# Vivado block design design_1, xczu28dr-ffvg1517-2-e, Vivado 2019.1
# (continued, part 3 of 6)
current_bd_instance /tx_datapath/dac_block0_tile1
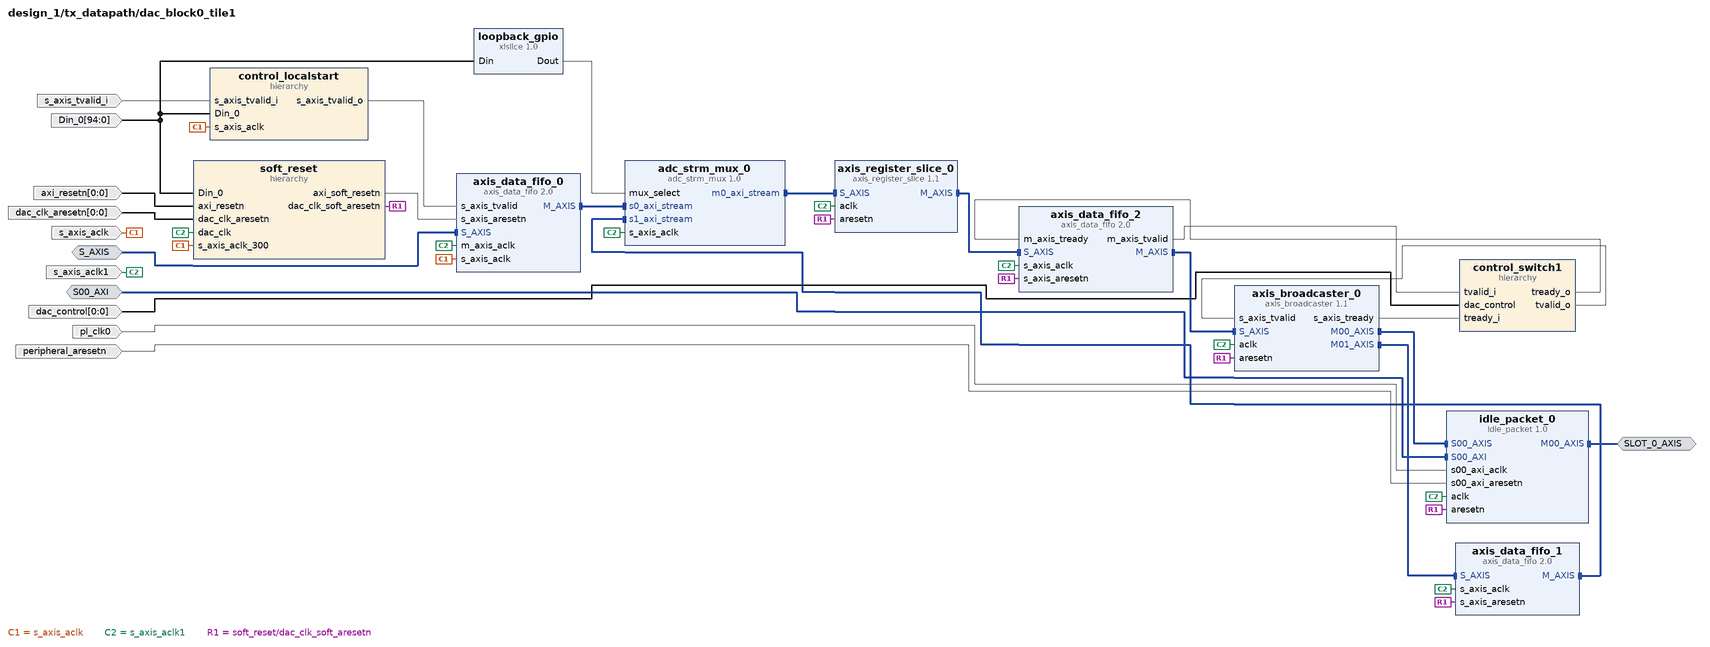
[diagram p42: block diagram inside /tx_datapath/dac_block0_tile1]
create_bd_intf_pin -mode Slave -vlnv xilinx.com:interface:axis_rtl:1.0 S_AXIS
create_bd_intf_pin -mode Master -vlnv xilinx.com:interface:axis_rtl:1.0 SLOT_0_AXIS
create_bd_intf_pin -mode Slave -vlnv xilinx.com:interface:aximm_rtl:1.0 S00_AXI
create_bd_pin -dir I -type clk s_axis_aclk
create_bd_pin -dir I -type clk s_axis_aclk1
create_bd_pin -dir I -from 0 -to 0 dac_control
create_bd_pin -dir I -from 94 -to 0 Din_0
create_bd_pin -dir I -from 0 -to 0 axi_resetn
create_bd_pin -dir I -from 0 -to 0 dac_clk_aresetn
create_bd_pin -dir I s_axis_tvalid_i
create_bd_pin -dir I -type clk pl_clk0
create_bd_pin -dir I -type rst peripheral_aresetn

create_bd_cell -type ip -vlnv xilinx.com:ip:axis_data_fifo:2.0 axis_data_fifo_0
set_property -dict [list \
  CONFIG.FIFO_DEPTH 16 \
  CONFIG.FIFO_MEMORY_TYPE block \
  CONFIG.HAS_RD_DATA_COUNT 1 \
  CONFIG.HAS_TKEEP 1 \
  CONFIG.HAS_TLAST 1 \
  CONFIG.HAS_WR_DATA_COUNT 1 \
  CONFIG.IS_ACLK_ASYNC 1 \
  CONFIG.SYNCHRONIZATION_STAGES 2 \
  CONFIG.TDATA_NUM_BYTES 32 \
] [get_bd_cells axis_data_fifo_0]
create_bd_cell -type ip -vlnv xilinx.com:ip:axis_data_fifo:2.0 axis_data_fifo_1
set_property -dict [list \
  CONFIG.FIFO_DEPTH 16 \
  CONFIG.FIFO_MEMORY_TYPE block \
  CONFIG.HAS_RD_DATA_COUNT 1 \
  CONFIG.HAS_TKEEP 1 \
  CONFIG.HAS_TLAST 1 \
  CONFIG.HAS_WR_DATA_COUNT 1 \
  CONFIG.TDATA_NUM_BYTES 32 \
] [get_bd_cells axis_data_fifo_1]
create_bd_cell -type ip -vlnv xilinx.com:ip:axis_data_fifo:2.0 axis_data_fifo_2
set_property -dict [list \
  CONFIG.FIFO_DEPTH 4096 \
  CONFIG.FIFO_MEMORY_TYPE block \
  CONFIG.HAS_RD_DATA_COUNT 1 \
  CONFIG.HAS_TKEEP 1 \
  CONFIG.HAS_TLAST 1 \
  CONFIG.HAS_WR_DATA_COUNT 1 \
  CONFIG.TDATA_NUM_BYTES 32 \
] [get_bd_cells axis_data_fifo_2]
create_bd_cell -type ip -vlnv user.org:user:adc_strm_mux:1.0 adc_strm_mux_0
create_bd_cell -type ip -vlnv xilinx.com:ip:axis_register_slice:1.1 axis_register_slice_0
set_property -dict {CONFIG.HAS_TKEEP 1 CONFIG.HAS_TLAST 1 CONFIG.TDATA_NUM_BYTES 32} [get_bd_cells axis_register_slice_0]
create_bd_cell -type hier soft_reset
create_bd_cell -type ip -vlnv xilinx.com:ip:axis_broadcaster:1.1 axis_broadcaster_0
set_property -dict [list \
  CONFIG.M00_TDATA_REMAP {tdata[255:0]} \
  CONFIG.M01_TDATA_REMAP {tdata[255:0]} \
  CONFIG.M_TDATA_NUM_BYTES 32 \
  CONFIG.S_TDATA_NUM_BYTES 32 \
] [get_bd_cells axis_broadcaster_0]
create_bd_cell -type ip -vlnv xilinx.com:ip:xlslice:1.0 loopback_gpio
set_property -dict {CONFIG.DIN_FROM 12 CONFIG.DIN_TO 12 CONFIG.DIN_WIDTH 95 CONFIG.DOUT_WIDTH 1} [get_bd_cells loopback_gpio]
create_bd_cell -type hier control_switch1
create_bd_cell -type hier control_localstart
create_bd_cell -type ip -vlnv user.org:user:idle_packet:1.0 idle_packet_0

# ---- hierarchy /tx_datapath/dac_block0_tile1/soft_reset ----
current_bd_instance /tx_datapath/dac_block0_tile1/soft_reset
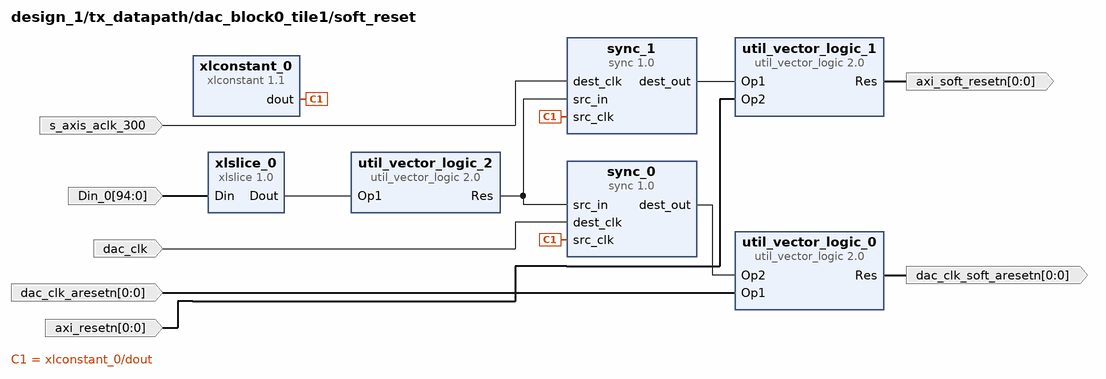
[diagram p43: block diagram inside /tx_datapath/dac_block0_tile1/soft_reset]
create_bd_pin -dir I -from 94 -to 0 Din_0
create_bd_pin -dir I -type clk dac_clk
create_bd_pin -dir I -type clk s_axis_aclk_300
create_bd_pin -dir O -from 0 -to 0 dac_clk_soft_aresetn
create_bd_pin -dir O -from 0 -to 0 axi_soft_resetn
create_bd_pin -dir I -from 0 -to 0 dac_clk_aresetn
create_bd_pin -dir I -from 0 -to 0 axi_resetn

create_bd_cell -type ip -vlnv xilinx.com:ip:xlslice:1.0 xlslice_0
set_property -dict {CONFIG.DIN_FROM 4 CONFIG.DIN_TO 4 CONFIG.DIN_WIDTH 95 CONFIG.DOUT_WIDTH 1} [get_bd_cells xlslice_0]
create_bd_cell -type ip -vlnv xilinx.com:user:sync:1.0 sync_0
set_property -dict {CONFIG.SRC_INPUT_REG 0} [get_bd_cells sync_0]
create_bd_cell -type ip -vlnv xilinx.com:user:sync:1.0 sync_1
set_property -dict {CONFIG.SRC_INPUT_REG 0} [get_bd_cells sync_1]
create_bd_cell -type ip -vlnv xilinx.com:ip:xlconstant:1.1 xlconstant_0
set_property -dict {CONFIG.CONST_VAL 0} [get_bd_cells xlconstant_0]
create_bd_cell -type ip -vlnv xilinx.com:ip:util_vector_logic:2.0 util_vector_logic_2
set_property -dict {CONFIG.C_OPERATION not CONFIG.C_SIZE 1} [get_bd_cells util_vector_logic_2]
create_bd_cell -type ip -vlnv xilinx.com:ip:util_vector_logic:2.0 util_vector_logic_0
set_property -dict {CONFIG.C_SIZE 1} [get_bd_cells util_vector_logic_0]
create_bd_cell -type ip -vlnv xilinx.com:ip:util_vector_logic:2.0 util_vector_logic_1
set_property -dict {CONFIG.C_SIZE 1} [get_bd_cells util_vector_logic_1]

# ---- hierarchy /tx_datapath/dac_block0_tile1/control_switch1 ----
current_bd_instance /tx_datapath/dac_block0_tile1/control_switch1
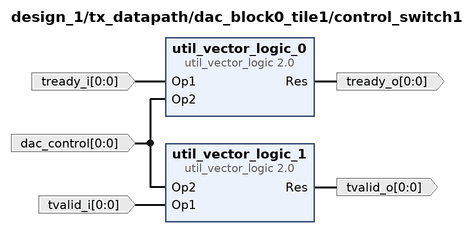
[diagram p44: block diagram inside /tx_datapath/dac_block0_tile1/control_switch1]
create_bd_pin -dir I -from 0 -to 0 tready_i
create_bd_pin -dir I -from 0 -to 0 tvalid_i
create_bd_pin -dir O -from 0 -to 0 tready_o
create_bd_pin -dir O -from 0 -to 0 tvalid_o
create_bd_pin -dir I -from 0 -to 0 dac_control

create_bd_cell -type ip -vlnv xilinx.com:ip:util_vector_logic:2.0 util_vector_logic_0
set_property -dict {CONFIG.C_SIZE 1} [get_bd_cells util_vector_logic_0]
create_bd_cell -type ip -vlnv xilinx.com:ip:util_vector_logic:2.0 util_vector_logic_1
set_property -dict {CONFIG.C_SIZE 1} [get_bd_cells util_vector_logic_1]

# ---- hierarchy /tx_datapath/dac_block0_tile1/control_localstart ----
current_bd_instance /tx_datapath/dac_block0_tile1/control_localstart
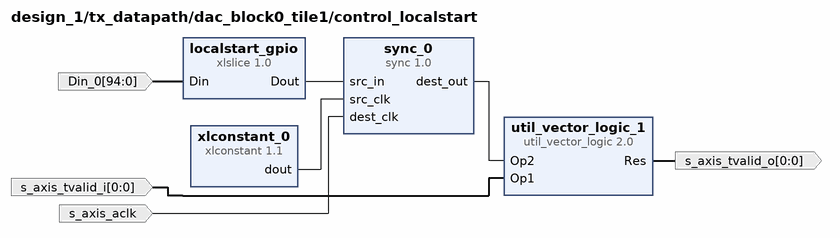
[diagram p45: block diagram inside /tx_datapath/dac_block0_tile1/control_localstart]
create_bd_pin -dir I -from 0 -to 0 s_axis_tvalid_i
create_bd_pin -dir O -from 0 -to 0 s_axis_tvalid_o
create_bd_pin -dir I -from 94 -to 0 Din_0
create_bd_pin -dir I -type clk s_axis_aclk

create_bd_cell -type ip -vlnv xilinx.com:ip:util_vector_logic:2.0 util_vector_logic_1
set_property -dict {CONFIG.C_SIZE 1} [get_bd_cells util_vector_logic_1]
create_bd_cell -type ip -vlnv xilinx.com:ip:xlslice:1.0 localstart_gpio
set_property -dict {CONFIG.DIN_FROM 20 CONFIG.DIN_TO 20 CONFIG.DIN_WIDTH 95 CONFIG.DOUT_WIDTH 1} [get_bd_cells localstart_gpio]
create_bd_cell -type ip -vlnv xilinx.com:user:sync:1.0 sync_0
set_property -dict {CONFIG.DEST_SYNC_FF 2 CONFIG.SRC_INPUT_REG 0} [get_bd_cells sync_0]
create_bd_cell -type ip -vlnv xilinx.com:ip:xlconstant:1.1 xlconstant_0
set_property -dict {CONFIG.CONST_VAL 0} [get_bd_cells xlconstant_0]

# ---- hierarchy /tx_datapath/dac_block1_tile1 ----
current_bd_instance /tx_datapath/dac_block1_tile1
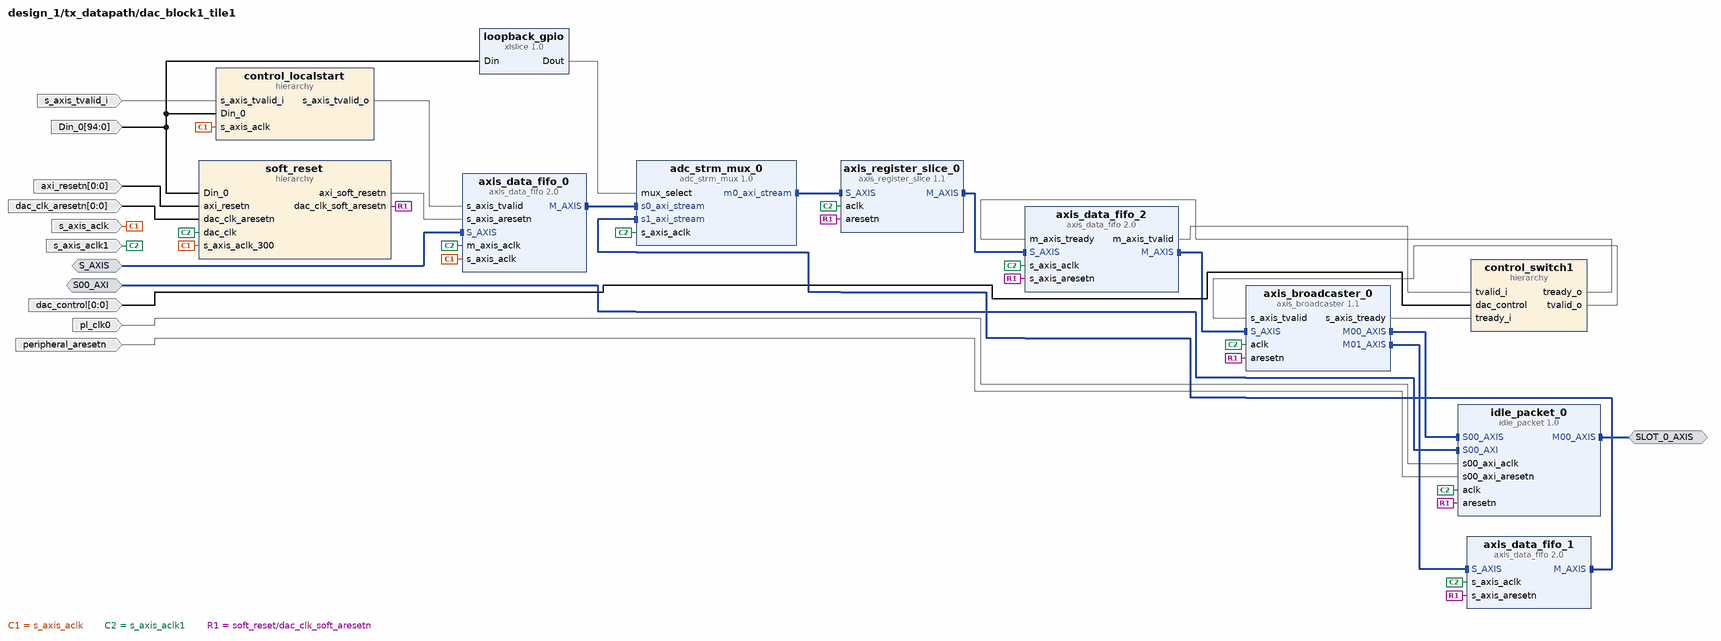
[diagram p46: block diagram inside /tx_datapath/dac_block1_tile1]
create_bd_intf_pin -mode Slave -vlnv xilinx.com:interface:axis_rtl:1.0 S_AXIS
create_bd_intf_pin -mode Master -vlnv xilinx.com:interface:axis_rtl:1.0 SLOT_0_AXIS
create_bd_intf_pin -mode Slave -vlnv xilinx.com:interface:aximm_rtl:1.0 S00_AXI
create_bd_pin -dir I -type clk s_axis_aclk
create_bd_pin -dir I -type clk s_axis_aclk1
create_bd_pin -dir I -from 0 -to 0 dac_control
create_bd_pin -dir I -from 94 -to 0 Din_0
create_bd_pin -dir I -from 0 -to 0 axi_resetn
create_bd_pin -dir I -from 0 -to 0 dac_clk_aresetn
create_bd_pin -dir I s_axis_tvalid_i
create_bd_pin -dir I -type clk pl_clk0
create_bd_pin -dir I -type rst peripheral_aresetn

create_bd_cell -type ip -vlnv xilinx.com:ip:axis_data_fifo:2.0 axis_data_fifo_0
set_property -dict [list \
  CONFIG.FIFO_DEPTH 16 \
  CONFIG.FIFO_MEMORY_TYPE block \
  CONFIG.HAS_RD_DATA_COUNT 1 \
  CONFIG.HAS_TKEEP 1 \
  CONFIG.HAS_TLAST 1 \
  CONFIG.HAS_WR_DATA_COUNT 1 \
  CONFIG.IS_ACLK_ASYNC 1 \
  CONFIG.SYNCHRONIZATION_STAGES 2 \
  CONFIG.TDATA_NUM_BYTES 32 \
] [get_bd_cells axis_data_fifo_0]
create_bd_cell -type ip -vlnv xilinx.com:ip:axis_data_fifo:2.0 axis_data_fifo_1
set_property -dict [list \
  CONFIG.FIFO_DEPTH 16 \
  CONFIG.FIFO_MEMORY_TYPE block \
  CONFIG.HAS_RD_DATA_COUNT 1 \
  CONFIG.HAS_TKEEP 1 \
  CONFIG.HAS_TLAST 1 \
  CONFIG.HAS_WR_DATA_COUNT 1 \
  CONFIG.TDATA_NUM_BYTES 32 \
] [get_bd_cells axis_data_fifo_1]
create_bd_cell -type ip -vlnv xilinx.com:ip:axis_data_fifo:2.0 axis_data_fifo_2
set_property -dict [list \
  CONFIG.FIFO_DEPTH 4096 \
  CONFIG.FIFO_MEMORY_TYPE block \
  CONFIG.HAS_RD_DATA_COUNT 1 \
  CONFIG.HAS_TKEEP 1 \
  CONFIG.HAS_TLAST 1 \
  CONFIG.HAS_WR_DATA_COUNT 1 \
  CONFIG.TDATA_NUM_BYTES 32 \
] [get_bd_cells axis_data_fifo_2]
create_bd_cell -type ip -vlnv user.org:user:adc_strm_mux:1.0 adc_strm_mux_0
create_bd_cell -type ip -vlnv xilinx.com:ip:axis_register_slice:1.1 axis_register_slice_0
set_property -dict {CONFIG.HAS_TKEEP 1 CONFIG.HAS_TLAST 1 CONFIG.TDATA_NUM_BYTES 32} [get_bd_cells axis_register_slice_0]
create_bd_cell -type hier soft_reset
create_bd_cell -type ip -vlnv xilinx.com:ip:axis_broadcaster:1.1 axis_broadcaster_0
set_property -dict [list \
  CONFIG.M00_TDATA_REMAP {tdata[255:0]} \
  CONFIG.M01_TDATA_REMAP {tdata[255:0]} \
  CONFIG.M_TDATA_NUM_BYTES 32 \
  CONFIG.S_TDATA_NUM_BYTES 32 \
] [get_bd_cells axis_broadcaster_0]
create_bd_cell -type ip -vlnv xilinx.com:ip:xlslice:1.0 loopback_gpio
set_property -dict {CONFIG.DIN_FROM 13 CONFIG.DIN_TO 13 CONFIG.DIN_WIDTH 95 CONFIG.DOUT_WIDTH 1} [get_bd_cells loopback_gpio]
create_bd_cell -type hier control_switch1
create_bd_cell -type hier control_localstart
create_bd_cell -type ip -vlnv user.org:user:idle_packet:1.0 idle_packet_0

# ---- hierarchy /tx_datapath/dac_block1_tile1/soft_reset ----
current_bd_instance /tx_datapath/dac_block1_tile1/soft_reset
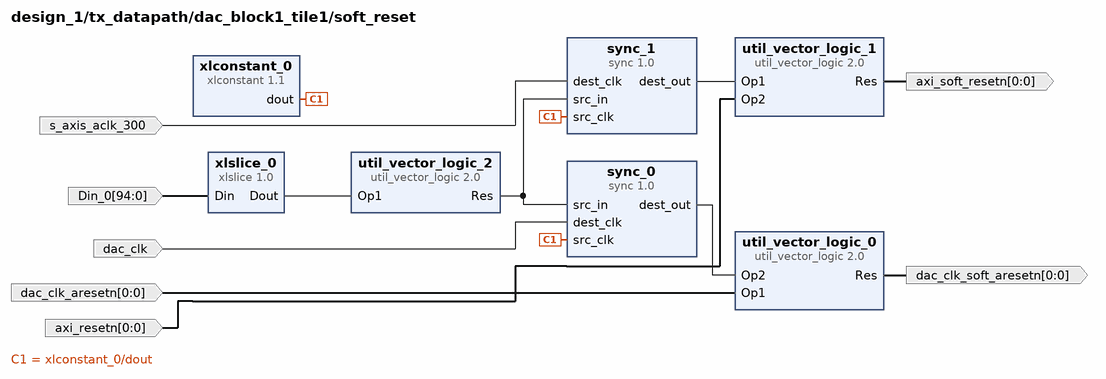
[diagram p47: block diagram inside /tx_datapath/dac_block1_tile1/soft_reset]
create_bd_pin -dir I -from 94 -to 0 Din_0
create_bd_pin -dir I -type clk dac_clk
create_bd_pin -dir I -type clk s_axis_aclk_300
create_bd_pin -dir O -from 0 -to 0 dac_clk_soft_aresetn
create_bd_pin -dir O -from 0 -to 0 axi_soft_resetn
create_bd_pin -dir I -from 0 -to 0 dac_clk_aresetn
create_bd_pin -dir I -from 0 -to 0 axi_resetn

create_bd_cell -type ip -vlnv xilinx.com:ip:xlslice:1.0 xlslice_0
set_property -dict {CONFIG.DIN_FROM 5 CONFIG.DIN_TO 5 CONFIG.DIN_WIDTH 95 CONFIG.DOUT_WIDTH 1} [get_bd_cells xlslice_0]
create_bd_cell -type ip -vlnv xilinx.com:user:sync:1.0 sync_0
set_property -dict {CONFIG.SRC_INPUT_REG 0} [get_bd_cells sync_0]
create_bd_cell -type ip -vlnv xilinx.com:user:sync:1.0 sync_1
set_property -dict {CONFIG.SRC_INPUT_REG 0} [get_bd_cells sync_1]
create_bd_cell -type ip -vlnv xilinx.com:ip:xlconstant:1.1 xlconstant_0
set_property -dict {CONFIG.CONST_VAL 0} [get_bd_cells xlconstant_0]
create_bd_cell -type ip -vlnv xilinx.com:ip:util_vector_logic:2.0 util_vector_logic_2
set_property -dict {CONFIG.C_OPERATION not CONFIG.C_SIZE 1} [get_bd_cells util_vector_logic_2]
create_bd_cell -type ip -vlnv xilinx.com:ip:util_vector_logic:2.0 util_vector_logic_0
set_property -dict {CONFIG.C_SIZE 1} [get_bd_cells util_vector_logic_0]
create_bd_cell -type ip -vlnv xilinx.com:ip:util_vector_logic:2.0 util_vector_logic_1
set_property -dict {CONFIG.C_SIZE 1} [get_bd_cells util_vector_logic_1]

# ---- hierarchy /tx_datapath/dac_block1_tile1/control_switch1 ----
current_bd_instance /tx_datapath/dac_block1_tile1/control_switch1
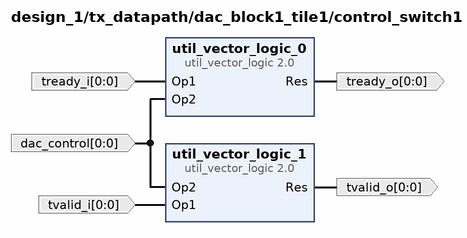
[diagram p48: block diagram inside /tx_datapath/dac_block1_tile1/control_switch1]
create_bd_pin -dir I -from 0 -to 0 tready_i
create_bd_pin -dir I -from 0 -to 0 tvalid_i
create_bd_pin -dir O -from 0 -to 0 tready_o
create_bd_pin -dir O -from 0 -to 0 tvalid_o
create_bd_pin -dir I -from 0 -to 0 dac_control

create_bd_cell -type ip -vlnv xilinx.com:ip:util_vector_logic:2.0 util_vector_logic_0
set_property -dict {CONFIG.C_SIZE 1} [get_bd_cells util_vector_logic_0]
create_bd_cell -type ip -vlnv xilinx.com:ip:util_vector_logic:2.0 util_vector_logic_1
set_property -dict {CONFIG.C_SIZE 1} [get_bd_cells util_vector_logic_1]

# ---- hierarchy /tx_datapath/dac_block1_tile1/control_localstart ----
current_bd_instance /tx_datapath/dac_block1_tile1/control_localstart
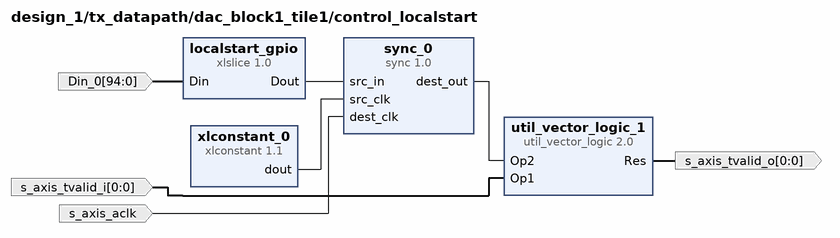
[diagram p49: block diagram inside /tx_datapath/dac_block1_tile1/control_localstart]
create_bd_pin -dir I -from 0 -to 0 s_axis_tvalid_i
create_bd_pin -dir O -from 0 -to 0 s_axis_tvalid_o
create_bd_pin -dir I -from 94 -to 0 Din_0
create_bd_pin -dir I -type clk s_axis_aclk

create_bd_cell -type ip -vlnv xilinx.com:ip:util_vector_logic:2.0 util_vector_logic_1
set_property -dict {CONFIG.C_SIZE 1} [get_bd_cells util_vector_logic_1]
create_bd_cell -type ip -vlnv xilinx.com:ip:xlslice:1.0 localstart_gpio
set_property -dict {CONFIG.DIN_FROM 21 CONFIG.DIN_TO 21 CONFIG.DIN_WIDTH 95 CONFIG.DOUT_WIDTH 1} [get_bd_cells localstart_gpio]
create_bd_cell -type ip -vlnv xilinx.com:user:sync:1.0 sync_0
set_property -dict {CONFIG.DEST_SYNC_FF 2 CONFIG.SRC_INPUT_REG 0} [get_bd_cells sync_0]
create_bd_cell -type ip -vlnv xilinx.com:ip:xlconstant:1.1 xlconstant_0
set_property -dict {CONFIG.CONST_VAL 0} [get_bd_cells xlconstant_0]

# ---- hierarchy /tx_datapath/dac_block3_tile1 ----
current_bd_instance /tx_datapath/dac_block3_tile1
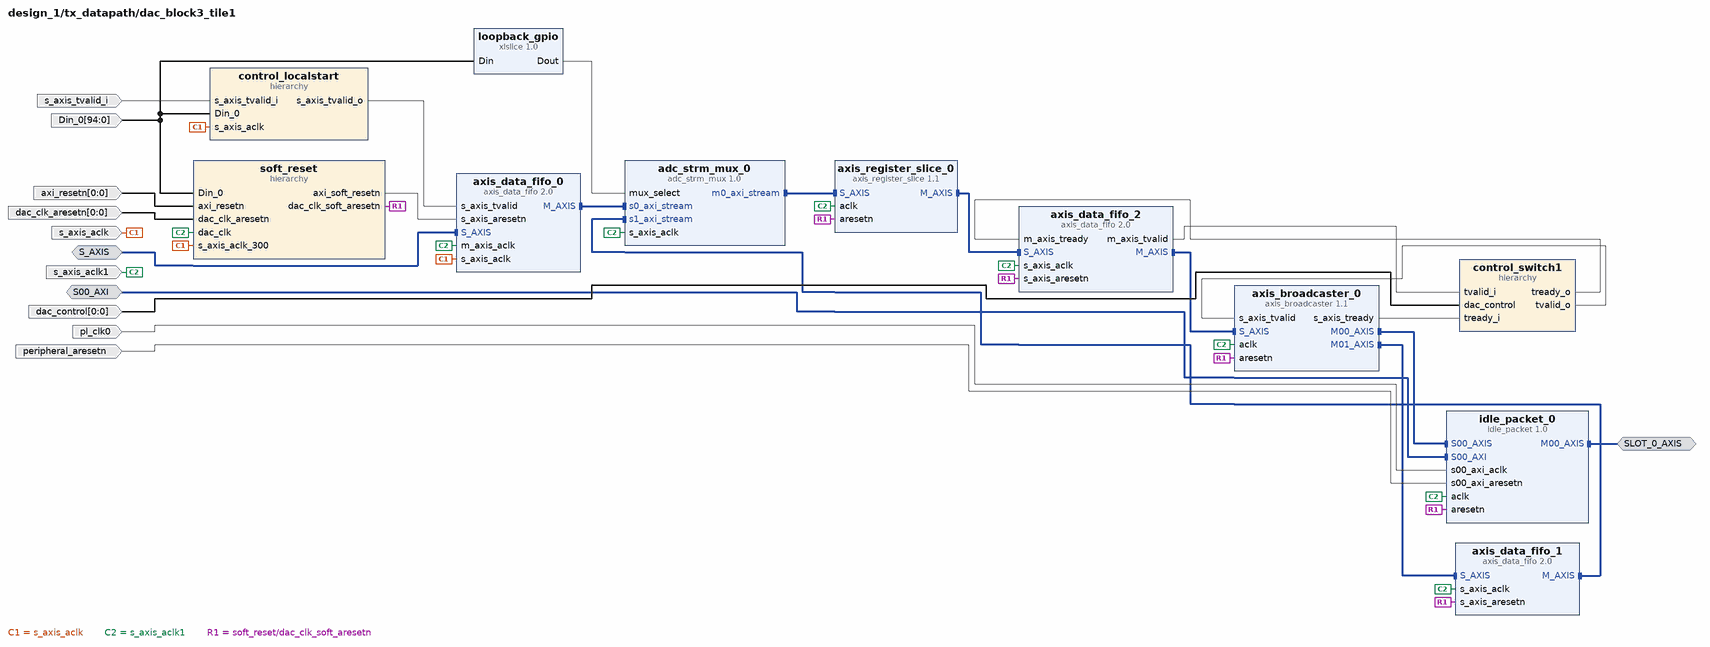
[diagram p50: block diagram inside /tx_datapath/dac_block3_tile1]
create_bd_intf_pin -mode Slave -vlnv xilinx.com:interface:axis_rtl:1.0 S_AXIS
create_bd_intf_pin -mode Master -vlnv xilinx.com:interface:axis_rtl:1.0 SLOT_0_AXIS
create_bd_intf_pin -mode Slave -vlnv xilinx.com:interface:aximm_rtl:1.0 S00_AXI
create_bd_pin -dir I -type clk s_axis_aclk
create_bd_pin -dir I -type clk s_axis_aclk1
create_bd_pin -dir I -from 0 -to 0 dac_control
create_bd_pin -dir I -from 94 -to 0 Din_0
create_bd_pin -dir I -from 0 -to 0 axi_resetn
create_bd_pin -dir I -from 0 -to 0 dac_clk_aresetn
create_bd_pin -dir I s_axis_tvalid_i
create_bd_pin -dir I -type clk pl_clk0
create_bd_pin -dir I -type rst peripheral_aresetn

create_bd_cell -type ip -vlnv xilinx.com:ip:axis_data_fifo:2.0 axis_data_fifo_0
set_property -dict [list \
  CONFIG.FIFO_DEPTH 16 \
  CONFIG.FIFO_MEMORY_TYPE block \
  CONFIG.HAS_RD_DATA_COUNT 1 \
  CONFIG.HAS_TKEEP 1 \
  CONFIG.HAS_TLAST 1 \
  CONFIG.HAS_WR_DATA_COUNT 1 \
  CONFIG.IS_ACLK_ASYNC 1 \
  CONFIG.SYNCHRONIZATION_STAGES 2 \
  CONFIG.TDATA_NUM_BYTES 32 \
] [get_bd_cells axis_data_fifo_0]
create_bd_cell -type ip -vlnv xilinx.com:ip:axis_data_fifo:2.0 axis_data_fifo_1
set_property -dict [list \
  CONFIG.FIFO_DEPTH 16 \
  CONFIG.FIFO_MEMORY_TYPE block \
  CONFIG.HAS_RD_DATA_COUNT 1 \
  CONFIG.HAS_TKEEP 1 \
  CONFIG.HAS_TLAST 1 \
  CONFIG.HAS_WR_DATA_COUNT 1 \
  CONFIG.TDATA_NUM_BYTES 32 \
] [get_bd_cells axis_data_fifo_1]
create_bd_cell -type ip -vlnv xilinx.com:ip:axis_data_fifo:2.0 axis_data_fifo_2
set_property -dict [list \
  CONFIG.FIFO_DEPTH 4096 \
  CONFIG.FIFO_MEMORY_TYPE block \
  CONFIG.HAS_RD_DATA_COUNT 1 \
  CONFIG.HAS_TKEEP 1 \
  CONFIG.HAS_TLAST 1 \
  CONFIG.HAS_WR_DATA_COUNT 1 \
  CONFIG.TDATA_NUM_BYTES 32 \
] [get_bd_cells axis_data_fifo_2]
create_bd_cell -type ip -vlnv user.org:user:adc_strm_mux:1.0 adc_strm_mux_0
create_bd_cell -type ip -vlnv xilinx.com:ip:axis_register_slice:1.1 axis_register_slice_0
set_property -dict {CONFIG.HAS_TKEEP 1 CONFIG.HAS_TLAST 1 CONFIG.TDATA_NUM_BYTES 32} [get_bd_cells axis_register_slice_0]
create_bd_cell -type hier soft_reset
create_bd_cell -type ip -vlnv xilinx.com:ip:axis_broadcaster:1.1 axis_broadcaster_0
set_property -dict [list \
  CONFIG.M00_TDATA_REMAP {tdata[255:0]} \
  CONFIG.M01_TDATA_REMAP {tdata[255:0]} \
  CONFIG.M_TDATA_NUM_BYTES 32 \
  CONFIG.S_TDATA_NUM_BYTES 32 \
] [get_bd_cells axis_broadcaster_0]
create_bd_cell -type ip -vlnv xilinx.com:ip:xlslice:1.0 loopback_gpio
set_property -dict {CONFIG.DIN_FROM 15 CONFIG.DIN_TO 15 CONFIG.DIN_WIDTH 95 CONFIG.DOUT_WIDTH 1} [get_bd_cells loopback_gpio]
create_bd_cell -type hier control_switch1
create_bd_cell -type hier control_localstart
create_bd_cell -type ip -vlnv user.org:user:idle_packet:1.0 idle_packet_0

# ---- hierarchy /tx_datapath/dac_block3_tile1/soft_reset ----
current_bd_instance /tx_datapath/dac_block3_tile1/soft_reset
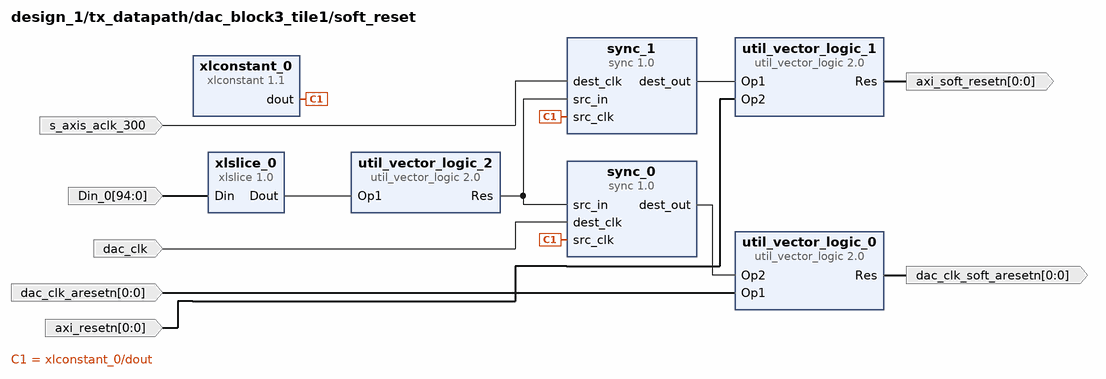
[diagram p51: block diagram inside /tx_datapath/dac_block3_tile1/soft_reset]
create_bd_pin -dir I -from 94 -to 0 Din_0
create_bd_pin -dir I -type clk dac_clk
create_bd_pin -dir I -type clk s_axis_aclk_300
create_bd_pin -dir O -from 0 -to 0 dac_clk_soft_aresetn
create_bd_pin -dir O -from 0 -to 0 axi_soft_resetn
create_bd_pin -dir I -from 0 -to 0 dac_clk_aresetn
create_bd_pin -dir I -from 0 -to 0 axi_resetn

create_bd_cell -type ip -vlnv xilinx.com:ip:xlslice:1.0 xlslice_0
set_property -dict {CONFIG.DIN_FROM 7 CONFIG.DIN_TO 7 CONFIG.DIN_WIDTH 95 CONFIG.DOUT_WIDTH 1} [get_bd_cells xlslice_0]
create_bd_cell -type ip -vlnv xilinx.com:user:sync:1.0 sync_0
set_property -dict {CONFIG.SRC_INPUT_REG 0} [get_bd_cells sync_0]
create_bd_cell -type ip -vlnv xilinx.com:user:sync:1.0 sync_1
set_property -dict {CONFIG.SRC_INPUT_REG 0} [get_bd_cells sync_1]
create_bd_cell -type ip -vlnv xilinx.com:ip:xlconstant:1.1 xlconstant_0
set_property -dict {CONFIG.CONST_VAL 0} [get_bd_cells xlconstant_0]
create_bd_cell -type ip -vlnv xilinx.com:ip:util_vector_logic:2.0 util_vector_logic_2
set_property -dict {CONFIG.C_OPERATION not CONFIG.C_SIZE 1} [get_bd_cells util_vector_logic_2]
create_bd_cell -type ip -vlnv xilinx.com:ip:util_vector_logic:2.0 util_vector_logic_0
set_property -dict {CONFIG.C_SIZE 1} [get_bd_cells util_vector_logic_0]
create_bd_cell -type ip -vlnv xilinx.com:ip:util_vector_logic:2.0 util_vector_logic_1
set_property -dict {CONFIG.C_SIZE 1} [get_bd_cells util_vector_logic_1]

# ---- hierarchy /tx_datapath/dac_block3_tile1/control_switch1 ----
current_bd_instance /tx_datapath/dac_block3_tile1/control_switch1
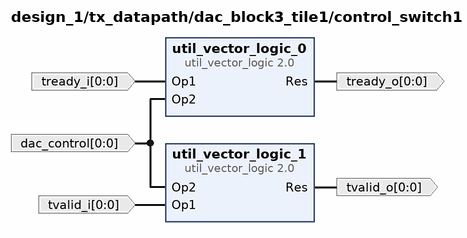
[diagram p52: block diagram inside /tx_datapath/dac_block3_tile1/control_switch1]
create_bd_pin -dir I -from 0 -to 0 tready_i
create_bd_pin -dir I -from 0 -to 0 tvalid_i
create_bd_pin -dir O -from 0 -to 0 tready_o
create_bd_pin -dir O -from 0 -to 0 tvalid_o
create_bd_pin -dir I -from 0 -to 0 dac_control

create_bd_cell -type ip -vlnv xilinx.com:ip:util_vector_logic:2.0 util_vector_logic_0
set_property -dict {CONFIG.C_SIZE 1} [get_bd_cells util_vector_logic_0]
create_bd_cell -type ip -vlnv xilinx.com:ip:util_vector_logic:2.0 util_vector_logic_1
set_property -dict {CONFIG.C_SIZE 1} [get_bd_cells util_vector_logic_1]

# ---- hierarchy /tx_datapath/dac_block3_tile1/control_localstart ----
current_bd_instance /tx_datapath/dac_block3_tile1/control_localstart
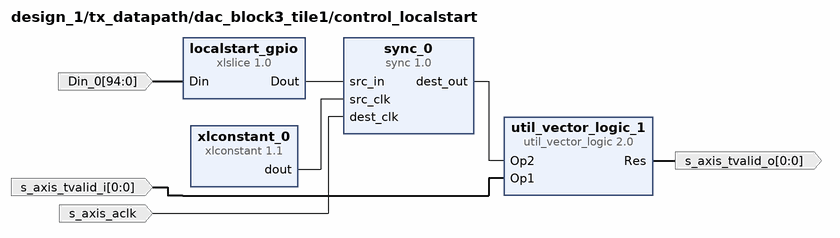
[diagram p53: block diagram inside /tx_datapath/dac_block3_tile1/control_localstart]
create_bd_pin -dir I -from 0 -to 0 s_axis_tvalid_i
create_bd_pin -dir O -from 0 -to 0 s_axis_tvalid_o
create_bd_pin -dir I -from 94 -to 0 Din_0
create_bd_pin -dir I -type clk s_axis_aclk

create_bd_cell -type ip -vlnv xilinx.com:ip:util_vector_logic:2.0 util_vector_logic_1
set_property -dict {CONFIG.C_SIZE 1} [get_bd_cells util_vector_logic_1]
create_bd_cell -type ip -vlnv xilinx.com:ip:xlslice:1.0 localstart_gpio
set_property -dict {CONFIG.DIN_FROM 23 CONFIG.DIN_TO 23 CONFIG.DIN_WIDTH 95 CONFIG.DOUT_WIDTH 1} [get_bd_cells localstart_gpio]
create_bd_cell -type ip -vlnv xilinx.com:user:sync:1.0 sync_0
set_property -dict {CONFIG.DEST_SYNC_FF 2 CONFIG.SRC_INPUT_REG 0} [get_bd_cells sync_0]
create_bd_cell -type ip -vlnv xilinx.com:ip:xlconstant:1.1 xlconstant_0
set_property -dict {CONFIG.CONST_VAL 0} [get_bd_cells xlconstant_0]

# ---- hierarchy /tx_datapath/tx_channelizer ----
current_bd_instance /tx_datapath/tx_channelizer
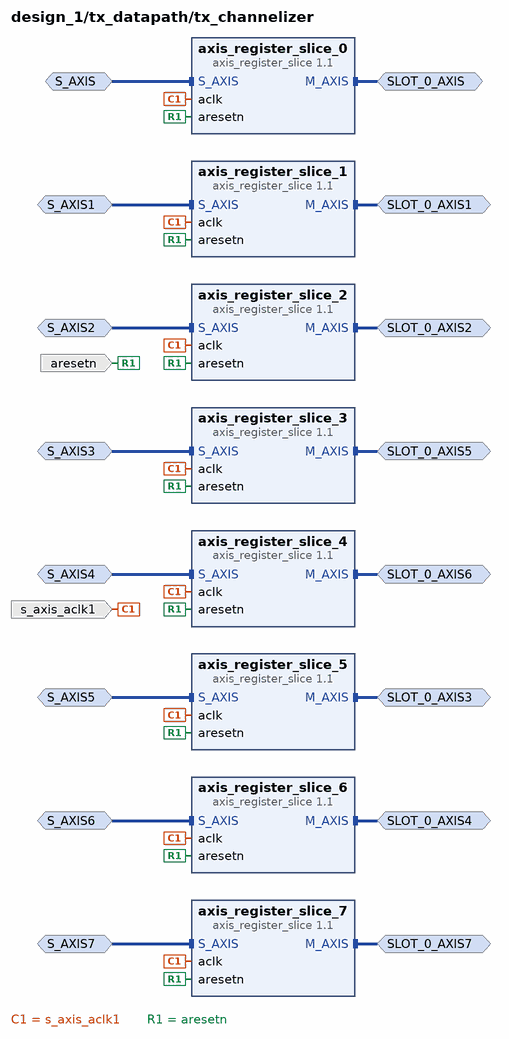
[diagram p54: block diagram inside /tx_datapath/tx_channelizer]
create_bd_intf_pin -mode Slave -vlnv xilinx.com:interface:axis_rtl:1.0 S_AXIS
create_bd_intf_pin -mode Master -vlnv xilinx.com:interface:axis_rtl:1.0 SLOT_0_AXIS
create_bd_intf_pin -mode Slave -vlnv xilinx.com:interface:axis_rtl:1.0 S_AXIS1
create_bd_intf_pin -mode Master -vlnv xilinx.com:interface:axis_rtl:1.0 SLOT_0_AXIS1
create_bd_intf_pin -mode Slave -vlnv xilinx.com:interface:axis_rtl:1.0 S_AXIS2
create_bd_intf_pin -mode Master -vlnv xilinx.com:interface:axis_rtl:1.0 SLOT_0_AXIS2
create_bd_intf_pin -mode Slave -vlnv xilinx.com:interface:axis_rtl:1.0 S_AXIS3
create_bd_intf_pin -mode Master -vlnv xilinx.com:interface:axis_rtl:1.0 SLOT_0_AXIS5
create_bd_intf_pin -mode Slave -vlnv xilinx.com:interface:axis_rtl:1.0 S_AXIS4
create_bd_intf_pin -mode Master -vlnv xilinx.com:interface:axis_rtl:1.0 SLOT_0_AXIS6
create_bd_intf_pin -mode Slave -vlnv xilinx.com:interface:axis_rtl:1.0 S_AXIS5
create_bd_intf_pin -mode Master -vlnv xilinx.com:interface:axis_rtl:1.0 SLOT_0_AXIS3
create_bd_intf_pin -mode Slave -vlnv xilinx.com:interface:axis_rtl:1.0 S_AXIS6
create_bd_intf_pin -mode Master -vlnv xilinx.com:interface:axis_rtl:1.0 SLOT_0_AXIS4
create_bd_intf_pin -mode Slave -vlnv xilinx.com:interface:axis_rtl:1.0 S_AXIS7
create_bd_intf_pin -mode Master -vlnv xilinx.com:interface:axis_rtl:1.0 SLOT_0_AXIS7
create_bd_pin -dir I -type clk s_axis_aclk1
create_bd_pin -dir I -type rst aresetn

create_bd_cell -type ip -vlnv xilinx.com:ip:axis_register_slice:1.1 axis_register_slice_0
create_bd_cell -type ip -vlnv xilinx.com:ip:axis_register_slice:1.1 axis_register_slice_1
create_bd_cell -type ip -vlnv xilinx.com:ip:axis_register_slice:1.1 axis_register_slice_3
create_bd_cell -type ip -vlnv xilinx.com:ip:axis_register_slice:1.1 axis_register_slice_4
create_bd_cell -type ip -vlnv xilinx.com:ip:axis_register_slice:1.1 axis_register_slice_5
create_bd_cell -type ip -vlnv xilinx.com:ip:axis_register_slice:1.1 axis_register_slice_6
create_bd_cell -type ip -vlnv xilinx.com:ip:axis_register_slice:1.1 axis_register_slice_7
create_bd_cell -type ip -vlnv xilinx.com:ip:axis_register_slice:1.1 axis_register_slice_2

# ---- connections ----

current_bd_instance /MTS_Block
connect_bd_intf_net [get_bd_intf_pins CLK_DIFF_SYSREF_CLK] [get_bd_intf_pins util_ds_buf_1/CLK_IN_D]
connect_bd_intf_net [get_bd_intf_pins CLK_DIFF_PL_CLK] [get_bd_intf_pins util_ds_buf_0/CLK_IN_D]
connect_bd_net [get_bd_pins util_ds_buf_0/IBUF_OUT] [get_bd_pins clk_wiz_0/clk_in1] [get_bd_pins sync_0/dest_clk]
connect_bd_net [get_bd_pins sync_0/dest_out] [get_bd_pins sync_1/src_in] [get_bd_pins sync_2/src_in]
connect_bd_net [get_bd_pins sync_1/dest_out] [get_bd_pins user_sysref_dac]
connect_bd_net [get_bd_pins xlconstant_0/dout] [get_bd_pins sync_0/src_clk] [get_bd_pins sync_1/src_clk] [get_bd_pins sync_2/src_clk]
connect_bd_net [get_bd_pins util_ds_buf_1/IBUF_OUT] [get_bd_pins sync_0/src_in]
connect_bd_net [get_bd_pins sync_2/dest_out] [get_bd_pins user_sysref_adc]
connect_bd_net [get_bd_pins clk_wiz_0/clk_out3] [get_bd_pins adc45_clk] [get_bd_pins sync_2/dest_clk]
connect_bd_net [get_bd_pins clk_wiz_0/clk_out1] [get_bd_pins dac45_clk] [get_bd_pins sync_1/dest_clk]
connect_bd_net [get_bd_pins clk_wiz_0/clk_out2] [get_bd_pins dac_clk]
connect_bd_net [get_bd_pins clk_wiz_0/clk_out4] [get_bd_pins adc_clk]

current_bd_instance /reset_block
connect_bd_net -net zynq_ultra_ps_e_0_pl_clk0 [get_bd_pins slowest_sync_clk] [get_bd_pins rst_ps8_0_96M/slowest_sync_clk]
connect_bd_net -net zynq_ultra_ps_e_0_pl_resetn0 [get_bd_pins ext_reset_in] \
  [get_bd_pins rst_ps8_0_96M1/ext_reset_in] [get_bd_pins rst_ps8_0_96M/ext_reset_in] \
  [get_bd_pins rst_ps8_0_96M2/ext_reset_in]
connect_bd_net [get_bd_pins rst_ps8_0_96M/peripheral_aresetn] [get_bd_pins peripheral_aresetn]
connect_bd_net -net MTS_Block_dac_clk [get_bd_pins slowest_sync_clk1] [get_bd_pins rst_ps8_0_96M1/slowest_sync_clk]
connect_bd_net [get_bd_pins rst_ps8_0_96M1/peripheral_aresetn] [get_bd_pins peripheral_aresetn1]
connect_bd_net [get_bd_pins rst_ddr4_0_333M/peripheral_aresetn] [get_bd_pins peripheral_aresetn2]
connect_bd_net -net slowest_sync_clk2_1 [get_bd_pins slowest_sync_clk2] [get_bd_pins rst_ddr4_0_333M/slowest_sync_clk]
connect_bd_net -net ext_reset_in1_1 [get_bd_pins ext_reset_in1] [get_bd_pins rst_ddr4_0_333M/ext_reset_in]
connect_bd_net [get_bd_pins rst_ps8_0_96M2/peripheral_aresetn] [get_bd_pins peripheral_aresetn3]
connect_bd_net -net slowest_sync_clk3_1 [get_bd_pins slowest_sync_clk3] [get_bd_pins rst_ps8_0_96M2/slowest_sync_clk]

current_bd_instance /dac_dma_block
connect_bd_intf_net [get_bd_intf_pins S_AXI_LITE] [get_bd_intf_pins axi_dma_0/S_AXI_LITE]
connect_bd_intf_net [get_bd_intf_pins axis_register_slice_0/M_AXIS] [get_bd_intf_pins axis_broadcaster_0/S_AXIS]
connect_bd_intf_net [get_bd_intf_pins M04_AXIS] [get_bd_intf_pins axis_broadcaster_0/M04_AXIS]
connect_bd_intf_net [get_bd_intf_pins M05_AXIS] [get_bd_intf_pins axis_broadcaster_0/M05_AXIS]
connect_bd_intf_net [get_bd_intf_pins M03_AXIS] [get_bd_intf_pins axis_broadcaster_0/M03_AXIS]
connect_bd_intf_net [get_bd_intf_pins M01_AXIS] [get_bd_intf_pins axis_broadcaster_0/M01_AXIS]
connect_bd_intf_net [get_bd_intf_pins M00_AXIS] [get_bd_intf_pins axis_broadcaster_0/M00_AXIS]
connect_bd_intf_net [get_bd_intf_pins axi_register_slice_0/S_AXI] [get_bd_intf_pins axi_dma_0/M_AXI_MM2S]
connect_bd_intf_net [get_bd_intf_pins M_AXI_MM2S] [get_bd_intf_pins axi_register_slice_0/M_AXI]
connect_bd_intf_net [get_bd_intf_pins axis_register_slice_0/S_AXIS] [get_bd_intf_pins axi_dma_0/M_AXIS_MM2S]
connect_bd_intf_net [get_bd_intf_pins M07_AXIS] [get_bd_intf_pins axis_broadcaster_0/M07_AXIS]
connect_bd_intf_net [get_bd_intf_pins M02_AXIS] [get_bd_intf_pins axis_broadcaster_0/M02_AXIS]
connect_bd_intf_net [get_bd_intf_pins M06_AXIS] [get_bd_intf_pins axis_broadcaster_0/M06_AXIS]
connect_bd_net -net zynq_ultra_ps_e_0_pl_clk0 [get_bd_pins s_axi_lite_aclk] [get_bd_pins axi_dma_0/s_axi_lite_aclk]
connect_bd_net -net rst_ps8_0_96M_peripheral_aresetn [get_bd_pins axi_resetn] [get_bd_pins axi_dma_0/axi_resetn]
connect_bd_net -net ddr4_0_c0_ddr4_ui_clk [get_bd_pins m_axi_mm2s_aclk] \
  [get_bd_pins axi_dma_0/m_axi_mm2s_aclk] [get_bd_pins axis_broadcaster_0/aclk] [get_bd_pins axi_register_slice_0/aclk] \
  [get_bd_pins axis_register_slice_0/aclk]
connect_bd_net [get_bd_pins aresetn_300Mhz] \
  [get_bd_pins axis_broadcaster_0/aresetn] [get_bd_pins axis_register_slice_0/aresetn] \
  [get_bd_pins axi_register_slice_0/aresetn]

current_bd_instance /ddr_block
connect_bd_intf_net [get_bd_intf_pins axi_register_slice_1/M_AXI] [get_bd_intf_pins smartconnect_0/S00_AXI]
connect_bd_intf_net [get_bd_intf_pins HPM0_AXI] [get_bd_intf_pins axi_register_slice_2/S_AXI]
connect_bd_intf_net [get_bd_intf_pins user_si570_sysclk] [get_bd_intf_pins ddr4_0/C0_SYS_CLK]
connect_bd_intf_net [get_bd_intf_pins axi_register_slice_3/M_AXI] [get_bd_intf_pins smartconnect_0/S02_AXI]
connect_bd_intf_net [get_bd_intf_pins axi_register_slice_0/M_AXI] [get_bd_intf_pins ddr4_0/C0_DDR4_S_AXI]
connect_bd_intf_net [get_bd_intf_pins smartconnect_0/M00_AXI] [get_bd_intf_pins axi_register_slice_0/S_AXI]
connect_bd_intf_net [get_bd_intf_pins ddr4_sdram] [get_bd_intf_pins ddr4_0/C0_DDR4]
connect_bd_intf_net [get_bd_intf_pins axi_register_slice_2/M_AXI] [get_bd_intf_pins smartconnect_0/S01_AXI]
connect_bd_intf_net [get_bd_intf_pins S_AXI] [get_bd_intf_pins axi_register_slice_3/S_AXI]
connect_bd_intf_net [get_bd_intf_pins S00_AXI] [get_bd_intf_pins axi_register_slice_1/S_AXI]
connect_bd_net [get_bd_pins ddr4_0/c0_ddr4_ui_clk] \
  [get_bd_pins c0_ddr4_ui_clk] [get_bd_pins smartconnect_0/aclk] [get_bd_pins axi_register_slice_0/aclk] \
  [get_bd_pins axi_register_slice_1/aclk] [get_bd_pins axi_register_slice_2/aclk] [get_bd_pins axi_register_slice_3/aclk]
connect_bd_net -net rst_ddr4_0_333M_peripheral_aresetn [get_bd_pins ARESETN] \
  [get_bd_pins ddr4_0/c0_ddr4_aresetn] [get_bd_pins smartconnect_0/aresetn] [get_bd_pins axi_register_slice_0/aresetn] \
  [get_bd_pins axi_register_slice_1/aresetn] [get_bd_pins axi_register_slice_2/aresetn] \
  [get_bd_pins axi_register_slice_3/aresetn]
connect_bd_net [get_bd_pins ddr4_0/c0_ddr4_ui_clk_sync_rst] [get_bd_pins c0_ddr4_ui_clk_sync_rst]
connect_bd_net [get_bd_pins reset] [get_bd_pins ddr4_0/sys_rst]

current_bd_instance /control_block
connect_bd_net -net Din_0_1 [get_bd_pins Din_0] [get_bd_pins globalstart_gpio_dac/Din] [get_bd_pins globalstart_gpio_adc/Din]
connect_bd_net -net xlslice_0_Dout [get_bd_pins globalstart_gpio_dac/Dout] [get_bd_pins sync_0/src_in]
connect_bd_net [get_bd_pins xlconstant_0/dout] [get_bd_pins sync_0/src_clk] [get_bd_pins sync_1/src_clk]
connect_bd_net -net dest_clk_0_1 [get_bd_pins dac_clk] [get_bd_pins sync_0/dest_clk]
connect_bd_net [get_bd_pins sync_0/dest_out] [get_bd_pins dac_control]
connect_bd_net [get_bd_pins sync_1/dest_out] [get_bd_pins adc_control]
connect_bd_net -net dest_clk_1 [get_bd_pins adc_clk] [get_bd_pins sync_1/dest_clk]
connect_bd_net [get_bd_pins globalstart_gpio_adc/Dout] [get_bd_pins sync_1/src_in]

current_bd_instance /SPB_blocks
connect_bd_intf_net [get_bd_intf_pins M00_AXIS3] [get_bd_intf_pins packet_counter_1/M00_AXIS]
connect_bd_intf_net [get_bd_intf_pins S05_AXIS] [get_bd_intf_pins packet_detector_11AD_2/S01_AXIS]
connect_bd_intf_net [get_bd_intf_pins packet_counter_1/S01_AXIS] [get_bd_intf_pins packet_detector_11AD_1/M01_AXIS]
connect_bd_intf_net [get_bd_intf_pins M01_AXIS3] [get_bd_intf_pins packet_counter_1/M01_AXIS]
connect_bd_intf_net [get_bd_intf_pins packet_detector_11AD_3/M00_AXIS] [get_bd_intf_pins packet_counter_3/S00_AXIS]
connect_bd_intf_net [get_bd_intf_pins boundary_d/S_AXIS] [get_bd_intf_pins packet_counter_0/M00_AXIS]
connect_bd_intf_net [get_bd_intf_pins M00_AXIS1] [get_bd_intf_pins packet_counter_2/M00_AXIS]
connect_bd_intf_net [get_bd_intf_pins S00_AXI] [get_bd_intf_pins packet_detector_11AD_3/S00_AXI]
connect_bd_intf_net [get_bd_intf_pins S00_AXI2] [get_bd_intf_pins packet_detector_11AD_0/S00_AXI]
connect_bd_intf_net [get_bd_intf_pins S00_AXI1] [get_bd_intf_pins packet_counter_3/S00_AXI]
connect_bd_intf_net [get_bd_intf_pins S03_AXIS] [get_bd_intf_pins packet_detector_11AD_1/S01_AXIS]
connect_bd_intf_net [get_bd_intf_pins S07_AXIS] [get_bd_intf_pins packet_detector_11AD_3/S01_AXIS]
connect_bd_intf_net [get_bd_intf_pins S06_AXIS] [get_bd_intf_pins packet_detector_11AD_3/S00_AXIS]
connect_bd_intf_net [get_bd_intf_pins M01_AXIS1] [get_bd_intf_pins packet_counter_2/M01_AXIS]
connect_bd_intf_net [get_bd_intf_pins packet_detector_11AD_2/M00_AXIS] [get_bd_intf_pins packet_counter_2/S00_AXIS]
connect_bd_intf_net [get_bd_intf_pins S04_AXIS] [get_bd_intf_pins packet_detector_11AD_2/S00_AXIS]
connect_bd_intf_net [get_bd_intf_pins S01_AXIS1] [get_bd_intf_pins packet_detector_11AD_0/S01_AXIS]
connect_bd_intf_net [get_bd_intf_pins M00_AXIS] [get_bd_intf_pins packet_counter_3/M00_AXIS]
connect_bd_intf_net [get_bd_intf_pins M01_AXIS] [get_bd_intf_pins packet_counter_3/M01_AXIS]
connect_bd_intf_net [get_bd_intf_pins M01_AXIS2] [get_bd_intf_pins boundary_d/M01_AXIS]
connect_bd_intf_net [get_bd_intf_pins S00_AXI3] [get_bd_intf_pins packet_counter_0/S00_AXI]
connect_bd_intf_net [get_bd_intf_pins S00_AXIS1] [get_bd_intf_pins packet_detector_11AD_0/S00_AXIS]
connect_bd_intf_net [get_bd_intf_pins M00_AXIS2] [get_bd_intf_pins boundary_d/M00_AXIS]
connect_bd_intf_net [get_bd_intf_pins packet_detector_11AD_0/M01_AXIS] [get_bd_intf_pins packet_counter_0/S01_AXIS]
connect_bd_intf_net [get_bd_intf_pins S02_AXIS] [get_bd_intf_pins packet_detector_11AD_1/S00_AXIS]
connect_bd_intf_net [get_bd_intf_pins packet_detector_11AD_0/M00_AXIS] [get_bd_intf_pins packet_counter_0/S00_AXIS]
connect_bd_intf_net [get_bd_intf_pins S00_AXI6] [get_bd_intf_pins packet_counter_2/S00_AXI]
connect_bd_intf_net [get_bd_intf_pins packet_detector_11AD_2/M01_AXIS] [get_bd_intf_pins packet_counter_2/S01_AXIS]
connect_bd_intf_net [get_bd_intf_pins packet_detector_11AD_3/M01_AXIS] [get_bd_intf_pins packet_counter_3/S01_AXIS]
connect_bd_intf_net [get_bd_intf_pins S00_AXI8] [get_bd_intf_pins packet_detector_11AD_1/S00_AXI]
connect_bd_intf_net [get_bd_intf_pins S00_AXI7] [get_bd_intf_pins packet_counter_1/S00_AXI]
connect_bd_intf_net [get_bd_intf_pins S00_AXI5] [get_bd_intf_pins packet_detector_11AD_2/S00_AXI]
connect_bd_intf_net [get_bd_intf_pins packet_counter_1/S00_AXIS] [get_bd_intf_pins packet_detector_11AD_1/M00_AXIS]
connect_bd_intf_net [get_bd_intf_pins packet_counter_0/M01_AXIS] [get_bd_intf_pins boundary_d/S_AXIS1]
connect_bd_intf_net [get_bd_intf_pins S00_AXI4] [get_bd_intf_pins SIVERS_gpio_0/S00_AXI]
connect_bd_net [get_bd_pins aclk] \
  [get_bd_pins boundary_d/aclk] [get_bd_pins SIVERS_gpio_0/aclk] [get_bd_pins packet_counter_0/aclk] \
  [get_bd_pins packet_counter_2/aclk] [get_bd_pins packet_counter_1/aclk] [get_bd_pins packet_counter_3/aclk] \
  [get_bd_pins packet_detector_11AD_0/aclk] [get_bd_pins packet_detector_11AD_2/aclk] \
  [get_bd_pins packet_detector_11AD_1/aclk] [get_bd_pins packet_detector_11AD_3/aclk]
connect_bd_net [get_bd_pins s00_axi_aclk] \
  [get_bd_pins SIVERS_gpio_0/s00_axi_aclk] [get_bd_pins packet_counter_0/s00_axi_aclk] \
  [get_bd_pins packet_counter_2/s00_axi_aclk] [get_bd_pins packet_counter_1/s00_axi_aclk] \
  [get_bd_pins packet_counter_3/s00_axi_aclk] [get_bd_pins packet_detector_11AD_0/s00_axi_aclk] \
  [get_bd_pins packet_detector_11AD_2/s00_axi_aclk] [get_bd_pins packet_detector_11AD_1/s00_axi_aclk] \
  [get_bd_pins packet_detector_11AD_3/s00_axi_aclk]
connect_bd_net [get_bd_pins s00_axi_aresetn] \
  [get_bd_pins SIVERS_gpio_0/s00_axi_aresetn] [get_bd_pins packet_counter_0/s00_axi_aresetn] \
  [get_bd_pins packet_counter_2/s00_axi_aresetn] [get_bd_pins packet_counter_1/s00_axi_aresetn] \
  [get_bd_pins packet_counter_3/s00_axi_aresetn] [get_bd_pins packet_detector_11AD_0/s00_axi_aresetn] \
  [get_bd_pins packet_detector_11AD_2/s00_axi_aresetn] [get_bd_pins packet_detector_11AD_1/s00_axi_aresetn] \
  [get_bd_pins packet_detector_11AD_3/s00_axi_aresetn]
connect_bd_net -net aresetn_1 [get_bd_pins adc_clk_soft_aresetn] \
  [get_bd_pins boundary_d/adc_clk_soft_aresetn] [get_bd_pins SIVERS_gpio_0/aresetn] [get_bd_pins packet_counter_0/aresetn] \
  [get_bd_pins packet_counter_2/aresetn] [get_bd_pins packet_counter_1/aresetn] [get_bd_pins packet_counter_3/aresetn] \
  [get_bd_pins packet_detector_11AD_0/aresetn] [get_bd_pins packet_detector_11AD_2/aresetn] \
  [get_bd_pins packet_detector_11AD_1/aresetn] [get_bd_pins packet_detector_11AD_3/aresetn]
connect_bd_net -net PD_FLAG1_1 [get_bd_pins PD_FLAG_block/Res] \
  [get_bd_pins boundary_d/i_PD_FLAG] [get_bd_pins packet_counter_0/PD_FLAG] [get_bd_pins packet_counter_2/PD_FLAG] \
  [get_bd_pins packet_counter_1/PD_FLAG] [get_bd_pins packet_counter_3/PD_FLAG]
connect_bd_net [get_bd_pins SIVERS_gpio_0/o_INC_BP] [get_bd_pins o_INC_BP_0]
connect_bd_net [get_bd_pins SIVERS_gpio_0/o_RST_BP] [get_bd_pins o_RST_BP_0]
connect_bd_net [get_bd_pins SIVERS_gpio_0/o_RTN_BP] [get_bd_pins o_RTN_BP_2]
connect_bd_net -net boundary_detector_0_o_BD_FLAG [get_bd_pins boundary_d/o_BD_FLAG] [get_bd_pins SIVERS_gpio_0/i_TRIGGER]
connect_bd_net [get_bd_pins packet_detector_11AD_0/PD_FLAG] [get_bd_pins PD_FLAG_block/Op4]
connect_bd_net [get_bd_pins packet_detector_11AD_2/PD_FLAG] [get_bd_pins PD_FLAG_block/Op1]
connect_bd_net [get_bd_pins packet_detector_11AD_1/PD_FLAG] [get_bd_pins PD_FLAG_block/Op2]
connect_bd_net [get_bd_pins packet_detector_11AD_3/PD_FLAG] [get_bd_pins PD_FLAG_block/Op3]
connect_bd_net -net dac_control_1 [get_bd_pins adc_control] [get_bd_pins control_switch0/adc_control]
connect_bd_net [get_bd_pins control_switch0/tvalid_o] \
  [get_bd_pins packet_detector_11AD_0/s01_axis_tvalid] [get_bd_pins packet_detector_11AD_0/s00_axis_tvalid] \
  [get_bd_pins packet_detector_11AD_2/s01_axis_tvalid] [get_bd_pins packet_detector_11AD_2/s00_axis_tvalid] \
  [get_bd_pins packet_detector_11AD_1/s01_axis_tvalid] [get_bd_pins packet_detector_11AD_1/s00_axis_tvalid] \
  [get_bd_pins packet_detector_11AD_3/s01_axis_tvalid] [get_bd_pins packet_detector_11AD_3/s00_axis_tvalid]
connect_bd_net -net tready_i_1 [get_bd_pins packet_detector_11AD_0/s00_axis_tready] [get_bd_pins control_switch0/tready_i]
connect_bd_net [get_bd_pins tvalid_i] [get_bd_pins control_switch0/tvalid_i]

current_bd_instance /SPB_blocks/PD_FLAG_block
connect_bd_net -net Op1_1 [get_bd_pins Op1] [get_bd_pins util_vector_logic_0/Op1]
connect_bd_net -net Op2_1 [get_bd_pins Op2] [get_bd_pins util_vector_logic_0/Op2]
connect_bd_net -net Op3_1 [get_bd_pins Op3] [get_bd_pins util_vector_logic_1/Op1]
connect_bd_net -net Op4_1 [get_bd_pins Op4] [get_bd_pins util_vector_logic_1/Op2]
connect_bd_net [get_bd_pins util_vector_logic_0/Res] [get_bd_pins util_vector_logic_2/Op1]
connect_bd_net [get_bd_pins util_vector_logic_1/Res] [get_bd_pins util_vector_logic_2/Op2]
connect_bd_net [get_bd_pins util_vector_logic_2/Res] [get_bd_pins Res]

current_bd_instance /SPB_blocks/control_switch0
connect_bd_net -net Op1_1_1 [get_bd_pins tvalid_i] [get_bd_pins util_vector_logic_1/Op1]
connect_bd_net [get_bd_pins util_vector_logic_0/Res] [get_bd_pins tready_o]
connect_bd_net -net util_vector_logic_2_Res [get_bd_pins adc_control] [get_bd_pins util_vector_logic_0/Op2] [get_bd_pins util_vector_logic_1/Op2]
connect_bd_net -net Op1_1 [get_bd_pins tready_i] [get_bd_pins util_vector_logic_0/Op1]
connect_bd_net [get_bd_pins util_vector_logic_1/Res] [get_bd_pins tvalid_o]

current_bd_instance /SPB_blocks/boundary_d
connect_bd_intf_net [get_bd_intf_pins M00_AXIS] [get_bd_intf_pins axis_dwidth_converter_2/M_AXIS]
connect_bd_intf_net [get_bd_intf_pins axis_dwidth_converter_0/M_AXIS] [get_bd_intf_pins boundary_detector_0/S00_AXIS]
connect_bd_intf_net [get_bd_intf_pins boundary_detector_0/M00_AXIS] [get_bd_intf_pins axis_dwidth_converter_2/S_AXIS]
connect_bd_intf_net [get_bd_intf_pins boundary_detector_0/M01_AXIS] [get_bd_intf_pins axis_dwidth_converter_3/S_AXIS]
connect_bd_intf_net [get_bd_intf_pins M01_AXIS] [get_bd_intf_pins axis_dwidth_converter_3/M_AXIS]
connect_bd_intf_net [get_bd_intf_pins S_AXIS] [get_bd_intf_pins axis_dwidth_converter_0/S_AXIS]
connect_bd_intf_net [get_bd_intf_pins axis_dwidth_converter_1/M_AXIS] [get_bd_intf_pins boundary_detector_0/S01_AXIS]
connect_bd_intf_net [get_bd_intf_pins S_AXIS1] [get_bd_intf_pins axis_dwidth_converter_1/S_AXIS]
connect_bd_net [get_bd_pins aclk] \
  [get_bd_pins axis_dwidth_converter_3/aclk] [get_bd_pins axis_dwidth_converter_2/aclk] \
  [get_bd_pins axis_dwidth_converter_0/aclk] [get_bd_pins axis_dwidth_converter_1/aclk] \
  [get_bd_pins boundary_detector_0/aclk]
connect_bd_net -net aresetn_1 [get_bd_pins adc_clk_soft_aresetn] \
  [get_bd_pins axis_dwidth_converter_0/aresetn] [get_bd_pins axis_dwidth_converter_3/aresetn] \
  [get_bd_pins axis_dwidth_converter_2/aresetn] [get_bd_pins axis_dwidth_converter_1/aresetn] \
  [get_bd_pins boundary_detector_0/aresetn]
connect_bd_net -net PD_FLAG1_1 [get_bd_pins i_PD_FLAG] [get_bd_pins boundary_detector_0/i_PD_FLAG]
connect_bd_net [get_bd_pins boundary_detector_0/o_BD_FLAG] [get_bd_pins o_BD_FLAG]

current_bd_instance /rx_datapath
connect_bd_intf_net [get_bd_intf_pins channel_mux/s0_axi_stream] [get_bd_intf_pins macro_channel_0/M_AXIS]
connect_bd_intf_net [get_bd_intf_pins S_AXIS] [get_bd_intf_pins rx_channelizer/S_AXIS3]
connect_bd_intf_net [get_bd_intf_pins S_AXIS1] [get_bd_intf_pins rx_channelizer/S_AXIS1]
connect_bd_intf_net [get_bd_intf_pins channel_mux/s3_axi_stream] [get_bd_intf_pins macro_channel_3/M_AXIS]
connect_bd_intf_net [get_bd_intf_pins S_AXIS5] [get_bd_intf_pins rx_channelizer/S_AXIS6]
connect_bd_intf_net [get_bd_intf_pins channel_mux/s2_axi_stream] [get_bd_intf_pins macro_channel_2/M_AXIS]
connect_bd_intf_net [get_bd_intf_pins S_AXIS0] [get_bd_intf_pins rx_channelizer/S_AXIS0]
connect_bd_intf_net [get_bd_intf_pins S_AXIS2] [get_bd_intf_pins rx_channelizer/S_AXIS2]
connect_bd_intf_net [get_bd_intf_pins S_AXIS4] [get_bd_intf_pins rx_channelizer/S_AXIS5]
connect_bd_intf_net [get_bd_intf_pins rx_channelizer/M_AXIS] [get_bd_intf_pins macro_channel_0/S_AXIS]
connect_bd_intf_net [get_bd_intf_pins s00_axi2] [get_bd_intf_pins macro_channel_3/s00_axi2]
connect_bd_intf_net [get_bd_intf_pins m_axi_stream] [get_bd_intf_pins channel_mux/m_axi_stream]
connect_bd_intf_net [get_bd_intf_pins s00_axi] [get_bd_intf_pins macro_channel_0/s00_axi]
connect_bd_intf_net [get_bd_intf_pins rx_channelizer/M_AXIS4] [get_bd_intf_pins macro_channel_3/S_AXIS]
connect_bd_intf_net [get_bd_intf_pins S_AXIS3] [get_bd_intf_pins rx_channelizer/S_AXIS4]
connect_bd_intf_net [get_bd_intf_pins channel_mux/s1_axi_stream] [get_bd_intf_pins macro_channel_1/M_AXIS]
connect_bd_intf_net [get_bd_intf_pins S_AXIS22] [get_bd_intf_pins rx_channelizer/S_AXIS]
connect_bd_intf_net [get_bd_intf_pins s00_axi3] [get_bd_intf_pins macro_channel_2/s00_axi3]
connect_bd_intf_net [get_bd_intf_pins rx_channelizer/M_AXIS1] [get_bd_intf_pins macro_channel_2/S_AXIS]
connect_bd_intf_net [get_bd_intf_pins s00_axi1] [get_bd_intf_pins macro_channel_1/s00_axi1]
connect_bd_intf_net [get_bd_intf_pins rx_channelizer/M_AXIS2] [get_bd_intf_pins macro_channel_1/S_AXIS]
connect_bd_net [get_bd_pins adc_clk] \
  [get_bd_pins soft_reset/adc_clk] [get_bd_pins rx_channelizer/adc_clk] [get_bd_pins macro_channel_0/adc_clk] \
  [get_bd_pins macro_channel_1/adc_clk] [get_bd_pins macro_channel_2/adc_clk] [get_bd_pins macro_channel_3/adc_clk]
connect_bd_net [get_bd_pins s_axis_aclk] \
  [get_bd_pins channel_mux/s_axis_aclk] [get_bd_pins soft_reset/s_axis_aclk_300] [get_bd_pins macro_channel_0/s_axis_aclk] \
  [get_bd_pins macro_channel_1/s_axis_aclk] [get_bd_pins macro_channel_2/s_axis_aclk] \
  [get_bd_pins macro_channel_3/s_axis_aclk]
connect_bd_net [get_bd_pins adc_clk_aresetn] [get_bd_pins soft_reset/adc_clk_aresetn]
connect_bd_net [get_bd_pins s00_axi_aclk] \
  [get_bd_pins macro_channel_0/s00_axi_aclk] [get_bd_pins macro_channel_1/s00_axi_aclk] \
  [get_bd_pins macro_channel_2/s00_axi_aclk] [get_bd_pins macro_channel_3/s00_axi_aclk]
connect_bd_net -net Din_0_1 [get_bd_pins Din_0] [get_bd_pins channel_mux/Din] [get_bd_pins soft_reset/Din_0]
connect_bd_net [get_bd_pins axi_resetn] [get_bd_pins channel_mux/resetn] [get_bd_pins soft_reset/axi_resetn]
connect_bd_net [get_bd_pins s00_axi_aresetn] \
  [get_bd_pins macro_channel_0/s00_axi_aresetn] [get_bd_pins macro_channel_1/s00_axi_aresetn] \
  [get_bd_pins macro_channel_2/s00_axi_aresetn] [get_bd_pins macro_channel_3/s00_axi_aresetn]
connect_bd_net -net adc_tile3_dac_clk_soft_aresetn [get_bd_pins soft_reset/adc_clk_soft_aresetn] \
  [get_bd_pins adc_clk_soft_aresetn] [get_bd_pins rx_channelizer/adc_clk_soft_aresetn] \
  [get_bd_pins macro_channel_0/adc_clk_soft_aresetn] [get_bd_pins macro_channel_1/adc_clk_soft_aresetn] \
  [get_bd_pins macro_channel_2/adc_clk_soft_aresetn] [get_bd_pins macro_channel_3/adc_clk_soft_aresetn]
connect_bd_net -net adc_tile3_m_axis_tvalid [get_bd_pins macro_channel_3/m_axis_tvalid] [get_bd_pins channel_mux/s3_axi_stream_tvalid]
connect_bd_net -net m_axis_tready_4 [get_bd_pins channel_mux/s3_axi_stream_tready] [get_bd_pins macro_channel_3/trdy]
connect_bd_net [get_bd_pins soft_reset/axi_soft_resetn] \
  [get_bd_pins macro_channel_0/rstn] [get_bd_pins macro_channel_1/rstn] [get_bd_pins macro_channel_2/rstn] \
  [get_bd_pins macro_channel_3/rstn] [get_bd_pins channel_mux/aresetn]
connect_bd_net [get_bd_pins channel_mux/s0_axis_tready] [get_bd_pins macro_channel_0/trdy]
connect_bd_net -net axis_data_fifo_0_m_axis_tvalid [get_bd_pins macro_channel_0/m_axis_tvalid] [get_bd_pins channel_mux/s0_axi_stream_tvalid]
connect_bd_net [get_bd_pins channel_mux/s1_axis_tready] [get_bd_pins macro_channel_1/m_axis_tready]
connect_bd_net -net axis_data_fifo_1_m_axis_tvalid [get_bd_pins macro_channel_1/m_axis_tvalid] [get_bd_pins channel_mux/s1_axi_stream_tvalid]
connect_bd_net [get_bd_pins channel_mux/s2_axi_stream_tready] [get_bd_pins macro_channel_2/trdy]
connect_bd_net -net axis_data_fifo_2_m_axis_tvalid [get_bd_pins macro_channel_2/m_axis_tvalid] [get_bd_pins channel_mux/s2_axi_stream_tvalid]
connect_bd_net -net s0_axis_tlast_1 [get_bd_pins macro_channel_0/tlast] [get_bd_pins channel_mux/s0_axis_tlast]
connect_bd_net -net s1_axi_tlast_1 [get_bd_pins macro_channel_1/tlast] [get_bd_pins channel_mux/s1_axi_tlast]
connect_bd_net -net s2_axi_stream_tlast_1 [get_bd_pins macro_channel_2/tlast] [get_bd_pins channel_mux/s2_axi_stream_tlast]
connect_bd_net -net s3_axi_stream_tlast_1 [get_bd_pins macro_channel_3/tlast] [get_bd_pins channel_mux/s3_axi_stream_tlast]
